# Altium schematic sheet Carrier.SchDoc
size A1; SheetNumber: 1; SheetTotal: 3
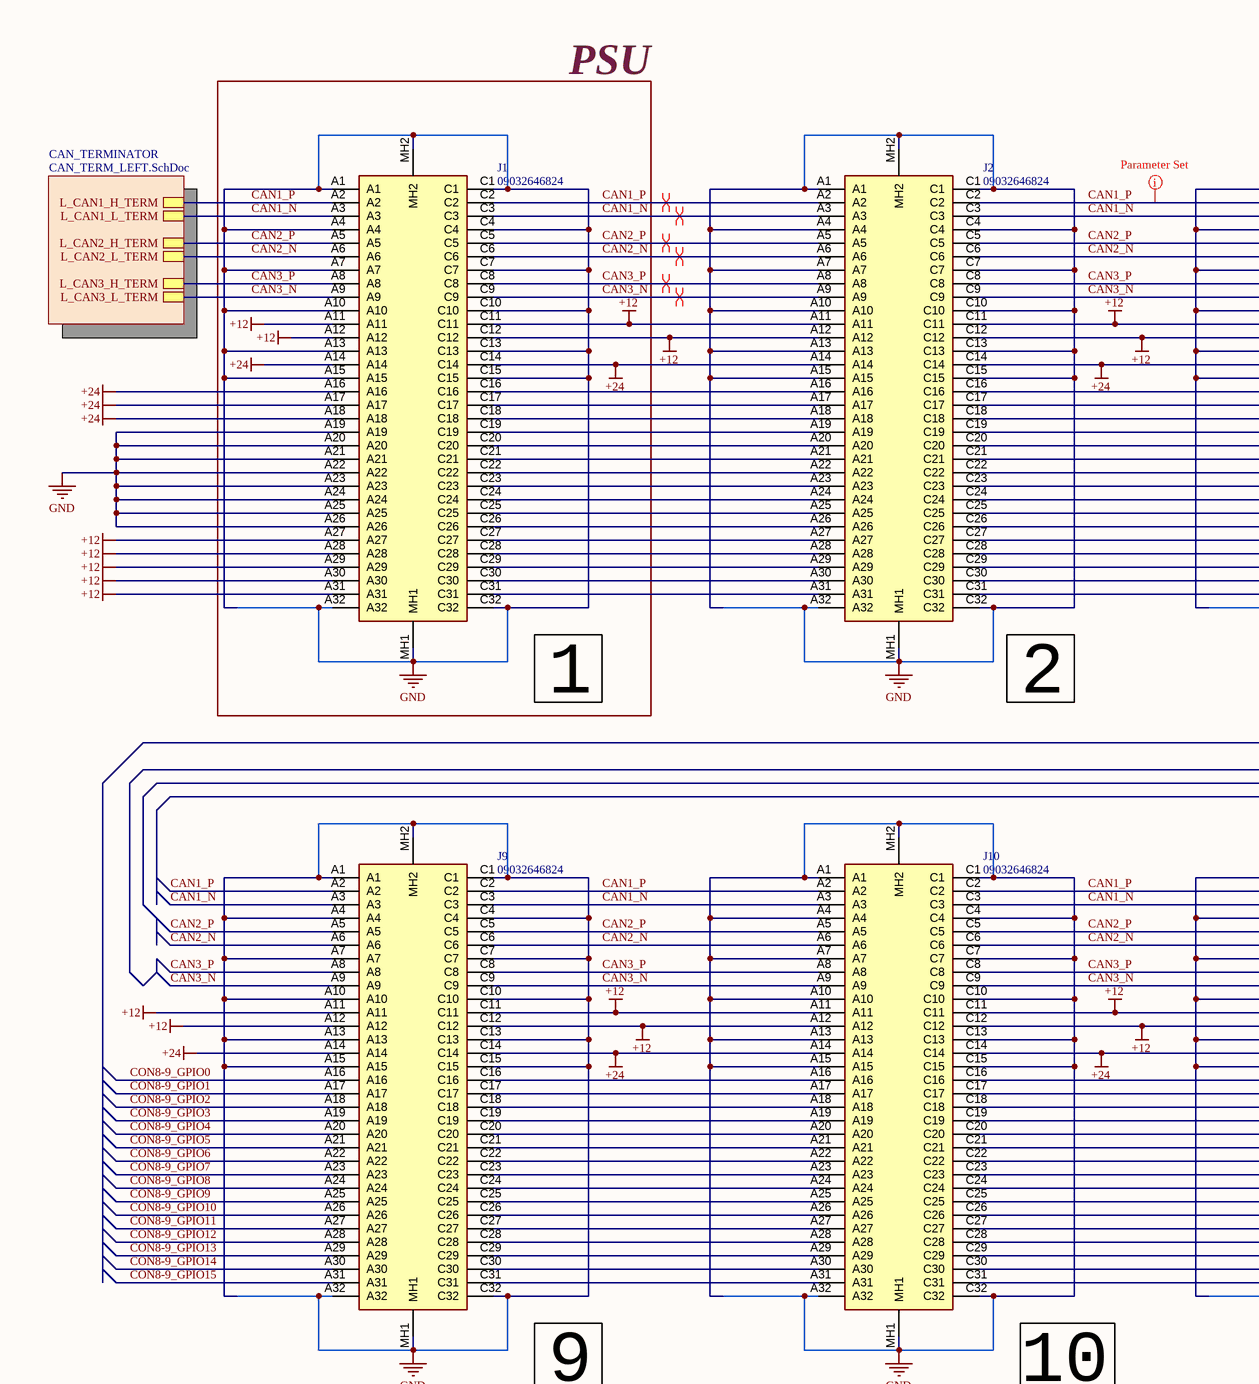
[diagram p0: Carrier.SchDoc, top left]
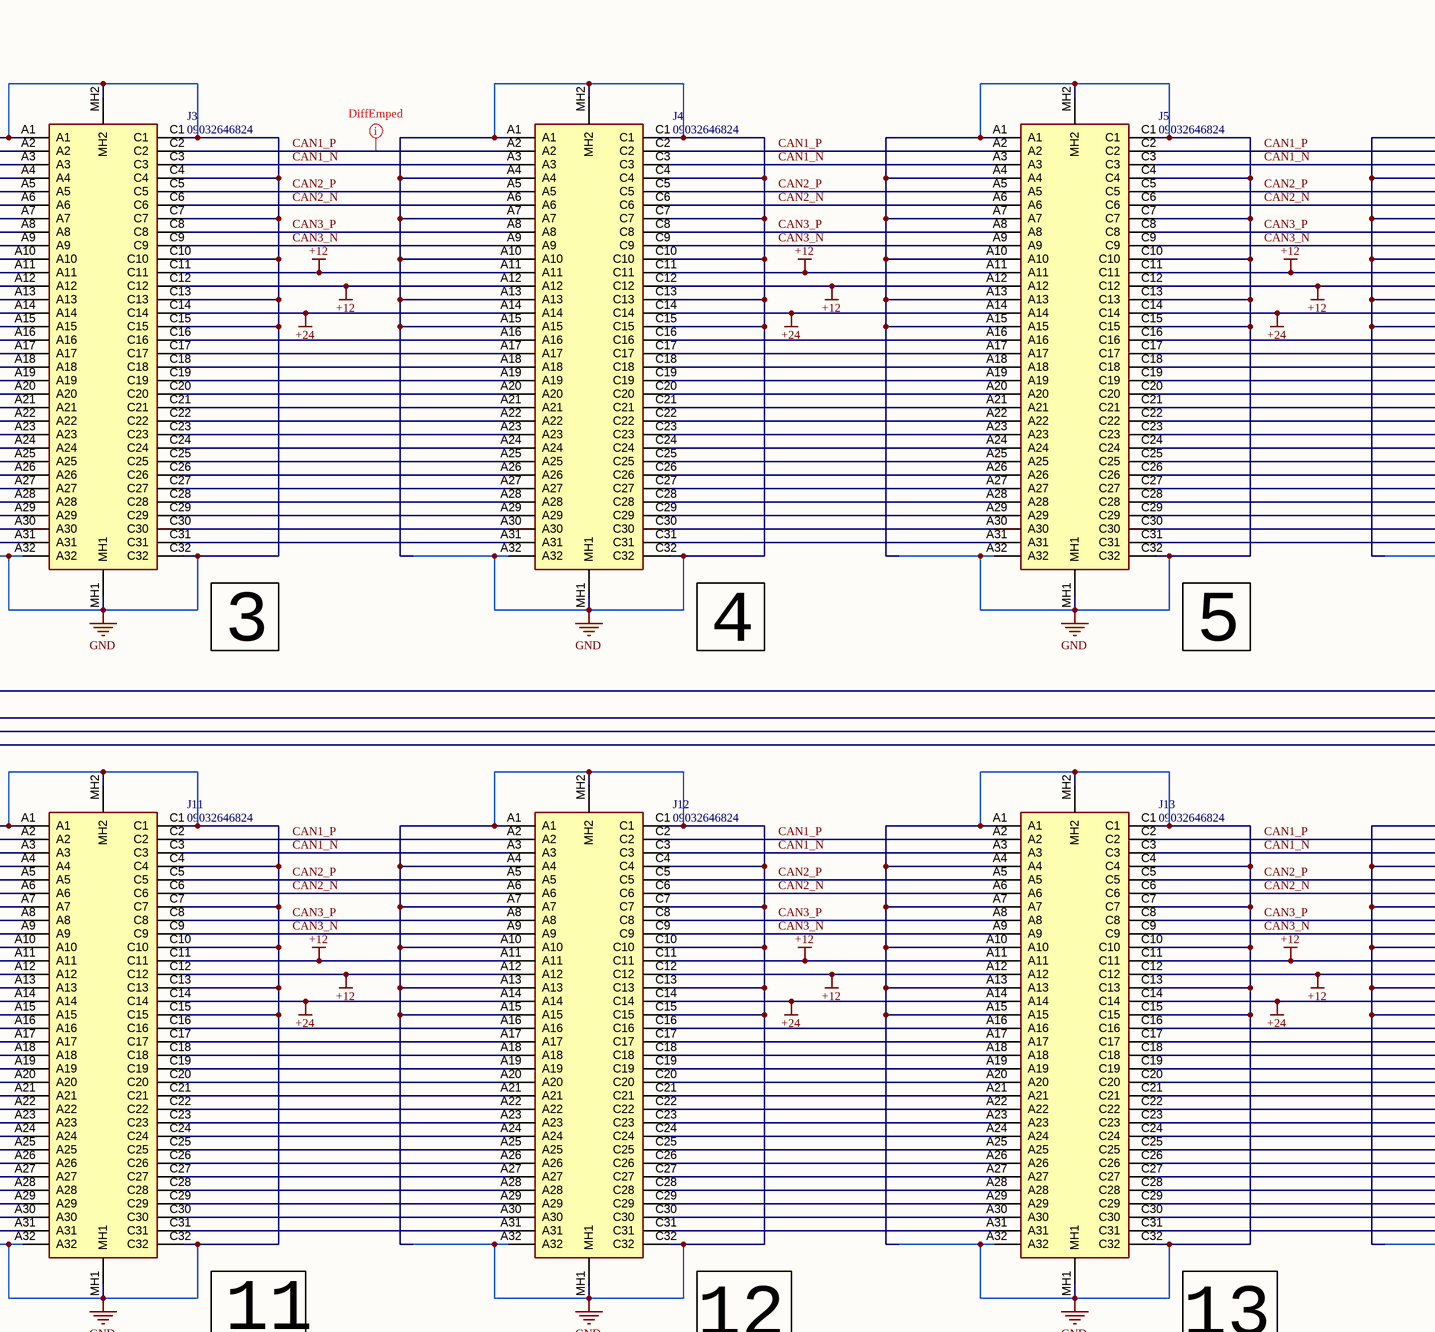
[diagram p1: Carrier.SchDoc, top middle]
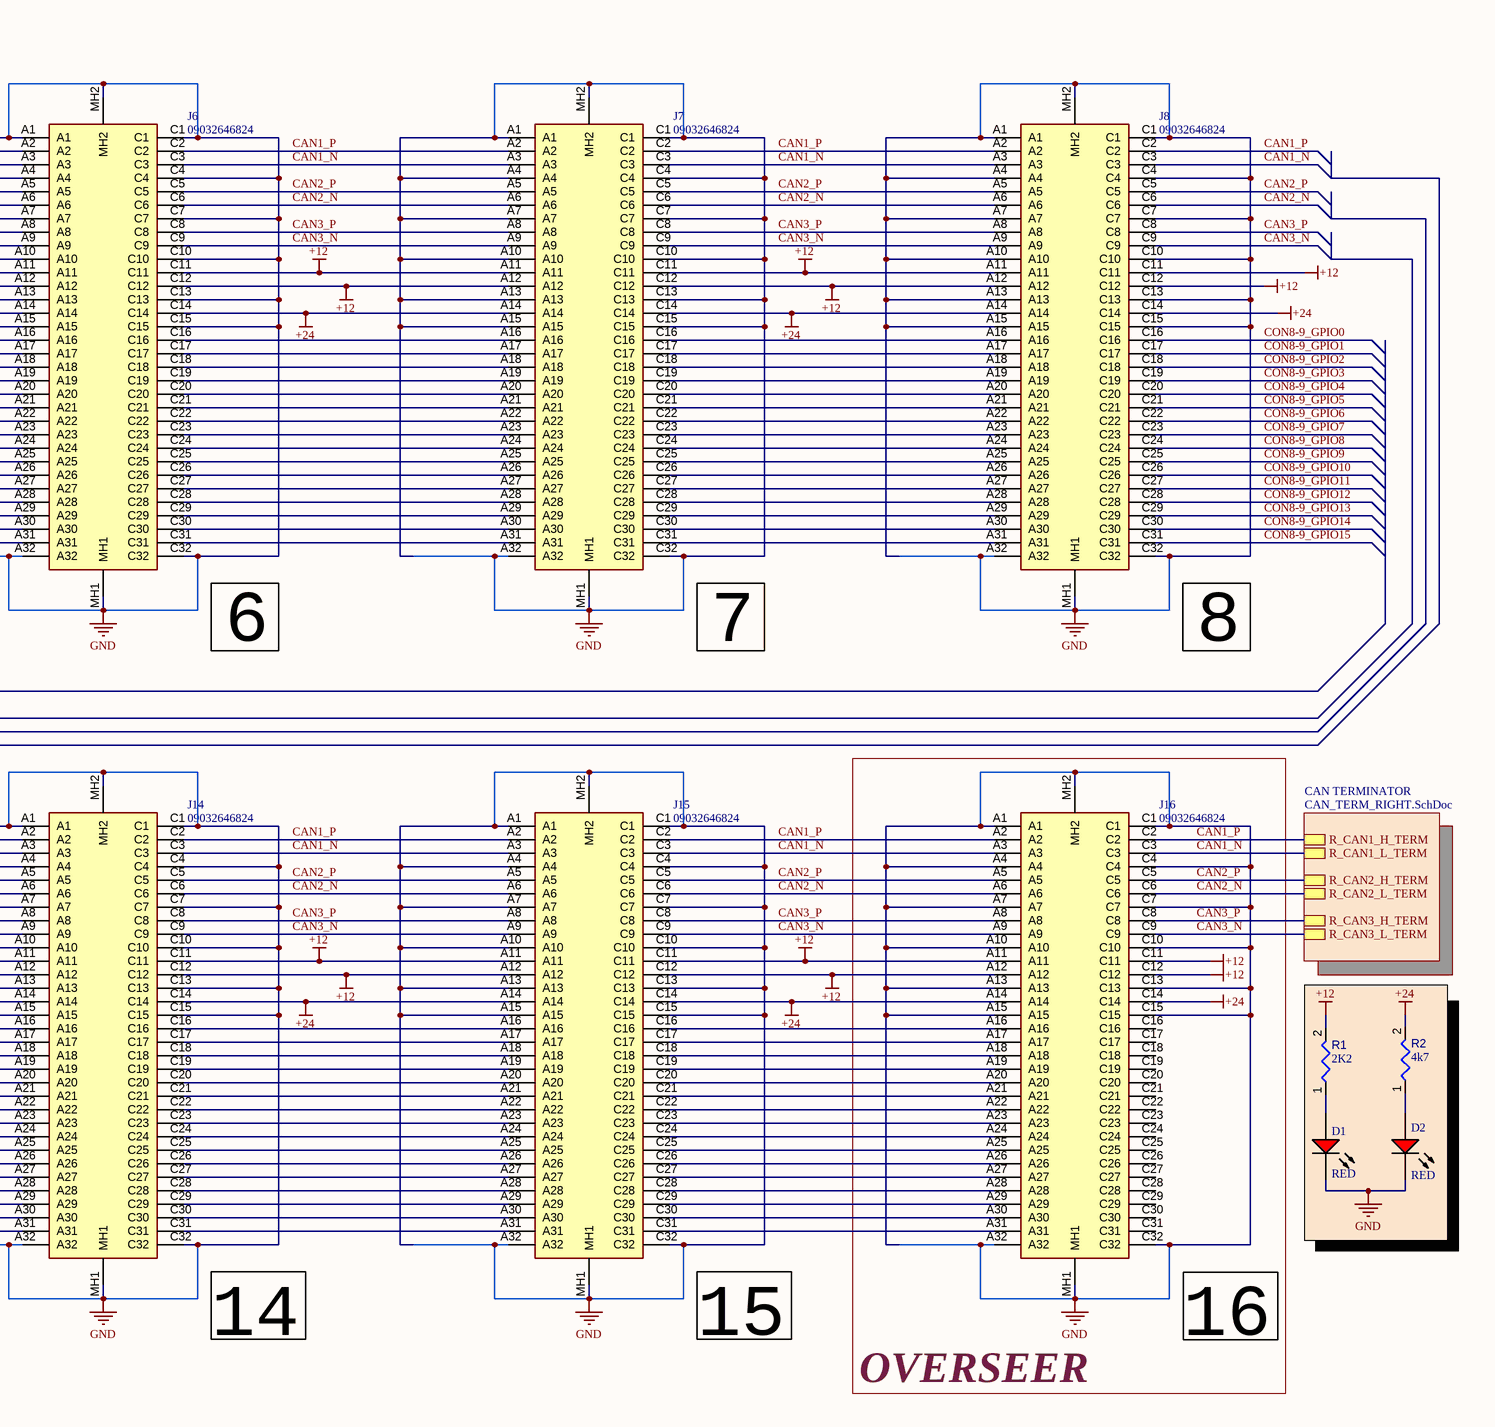
[diagram p2: Carrier.SchDoc, top right]
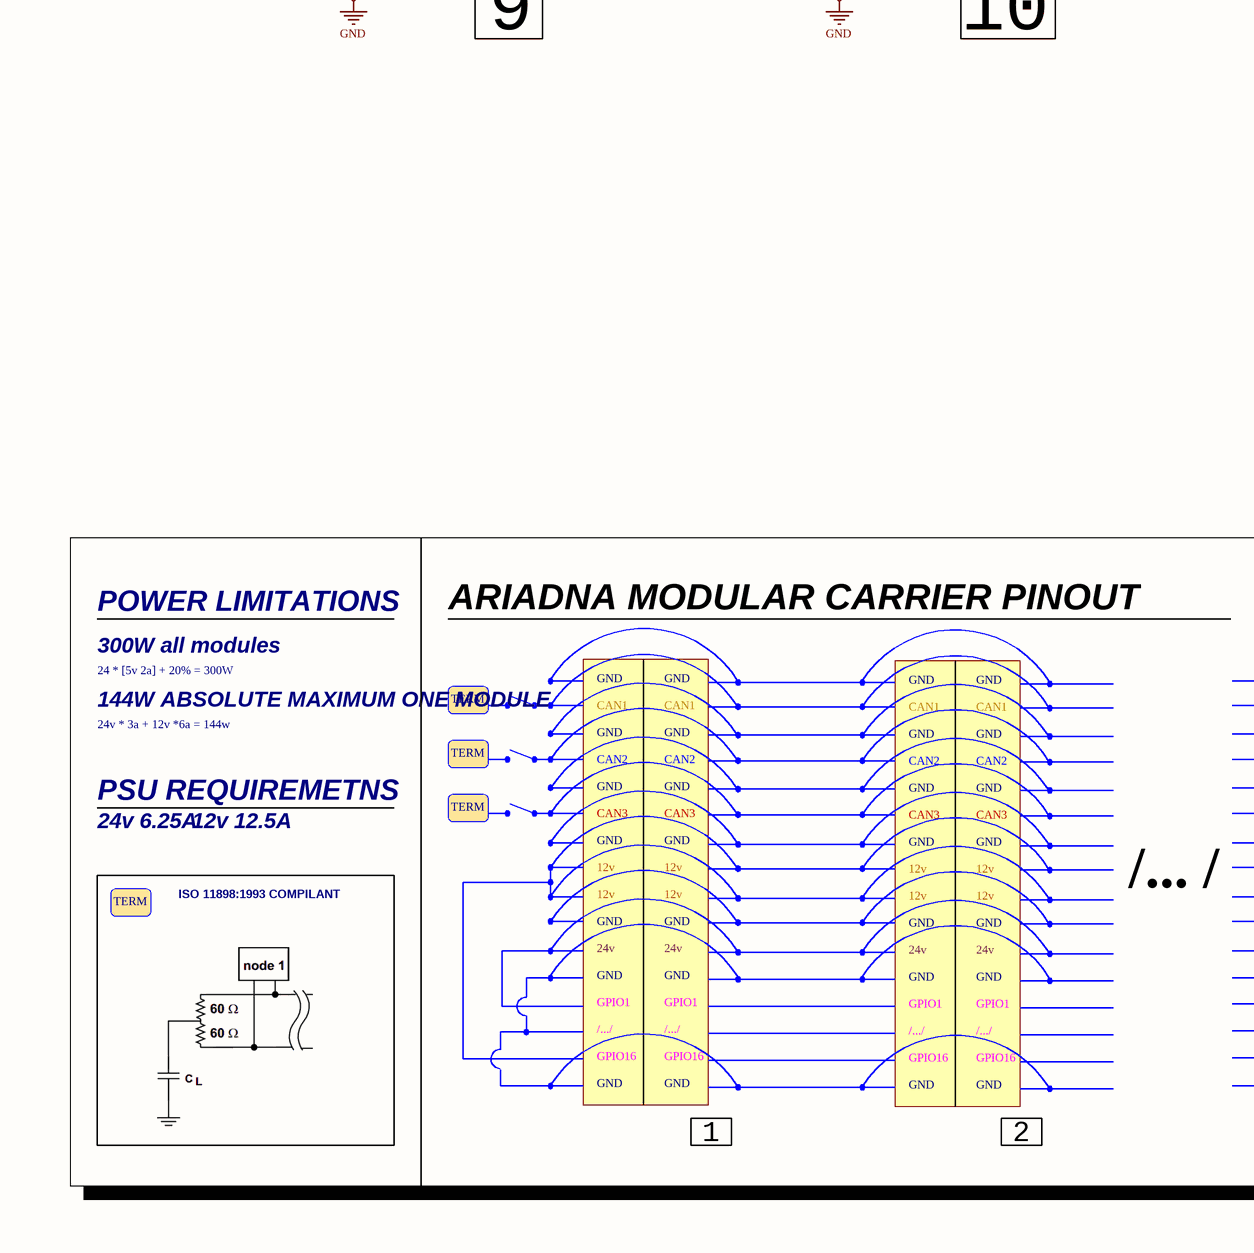
[diagram p3: Carrier.SchDoc, bottom left]
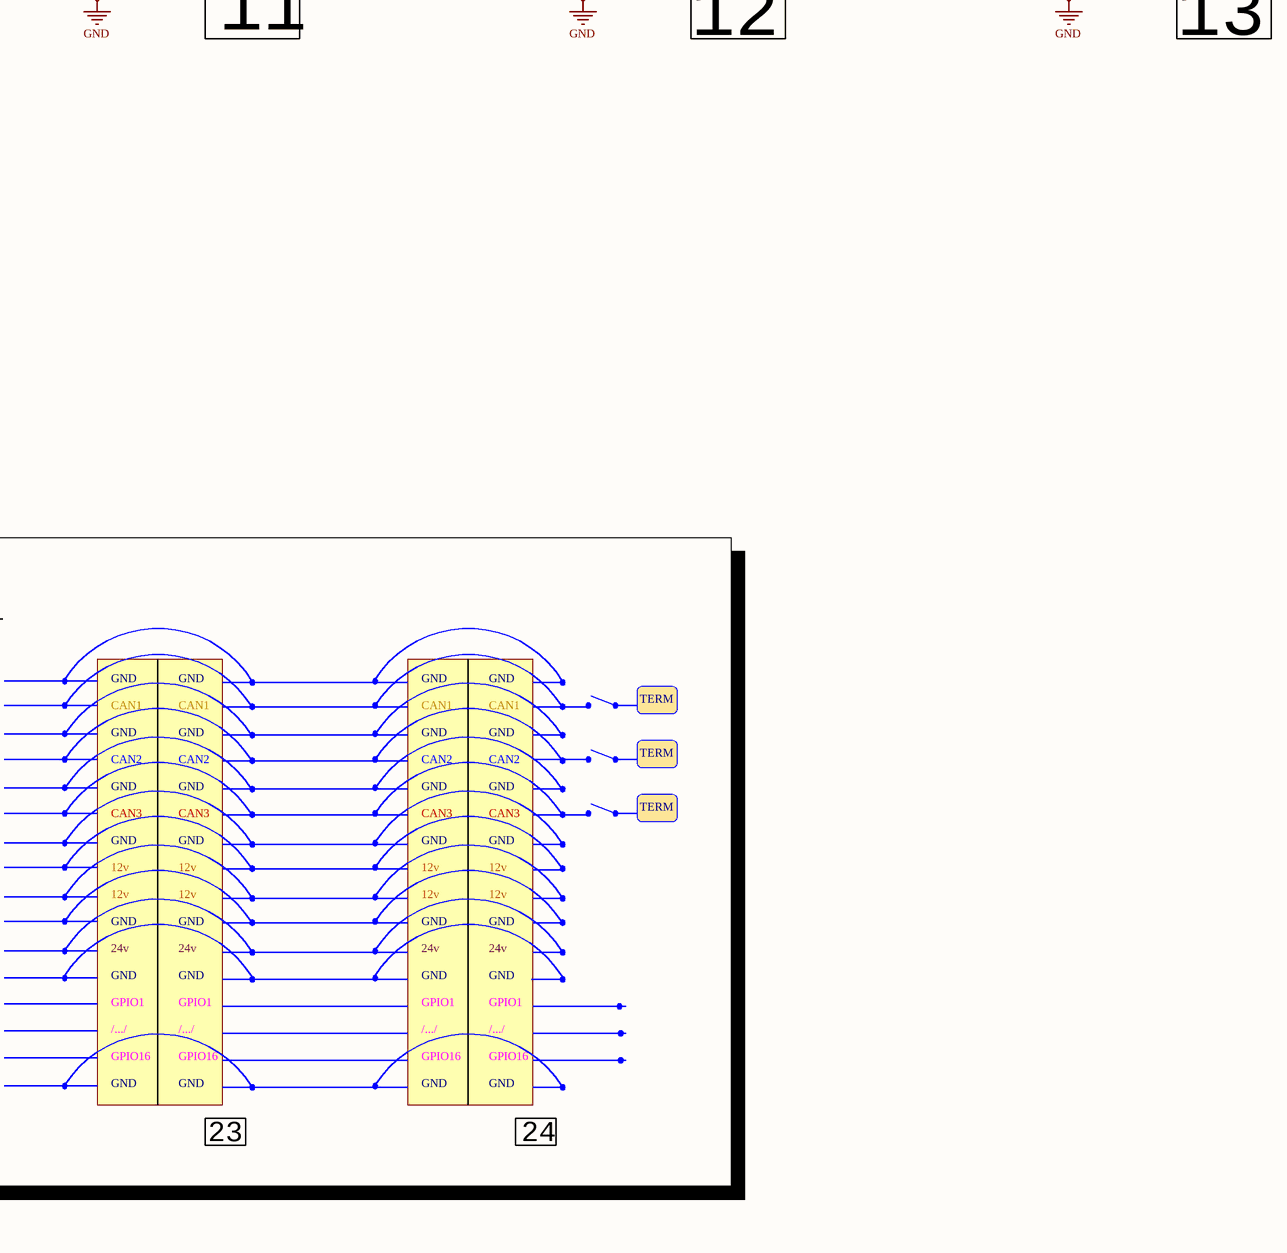
[diagram p4: Carrier.SchDoc, bottom middle]
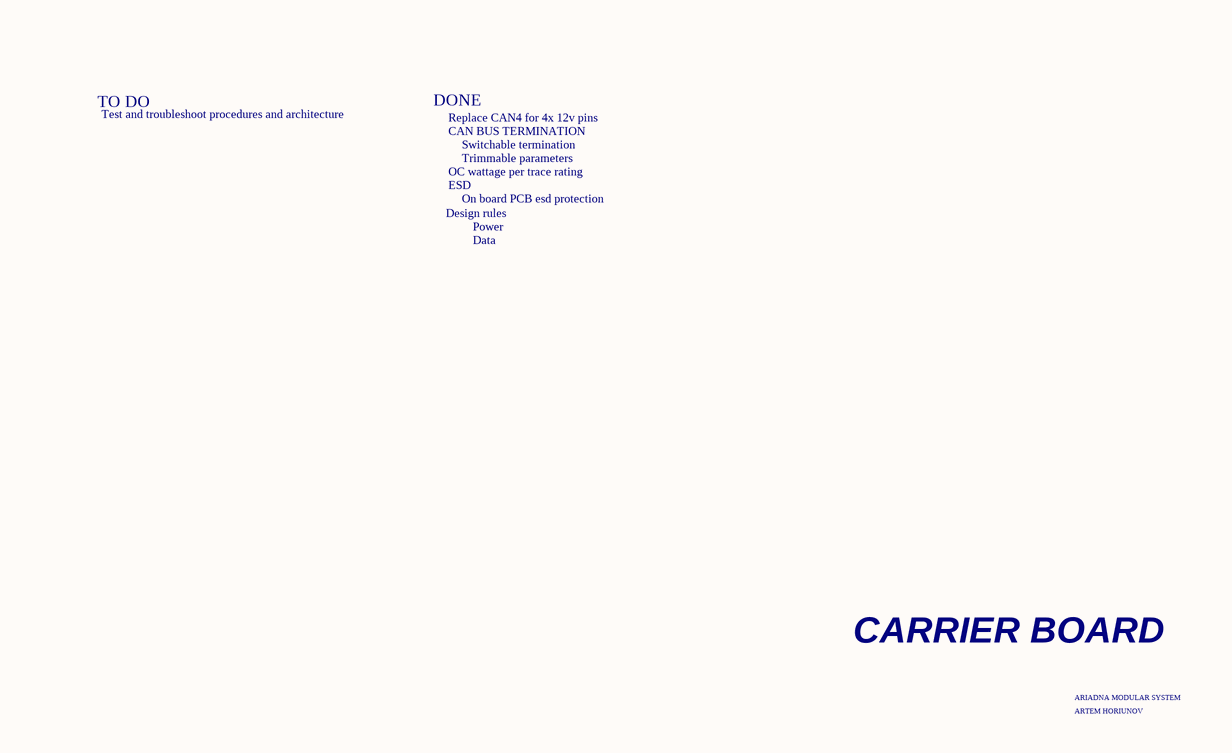
[diagram p5: Carrier.SchDoc, bottom right]

## Parts
D1  RED  [AVAG-HSMX-C190_V]
D2  RED  [AVAG-HSMX-C190_V]
J1  09032646824  [09032646824]
J2  09032646824  [09032646824]
J3  09032646824  [09032646824]
J4  09032646824  [09032646824]
J5  09032646824  [09032646824]
J6  09032646824  [09032646824]
J7  09032646824  [09032646824]
J8  09032646824  [09032646824]
J9  09032646824  [09032646824]
J10  09032646824  [09032646824]
J11  09032646824  [09032646824]
J12  09032646824  [09032646824]
J13  09032646824  [09032646824]
J14  09032646824  [09032646824]
J15  09032646824  [09032646824]
J16  09032646824  [09032646824]
R1  value 2K2  [RESC0805(2012)_L]  (hidden comment: 4D7R5J)
R2  value 4k7  [RESC0805(2012)_L]  (hidden comment: 4D7R5J)

## Blocks framed on the sheet
1: J1
16: J16

## Sub-sheets
CAN TERMINATOR = CAN_TERM_RIGHT.SchDoc: R_CAN1_H_TERM, R_CAN1_L_TERM, R_CAN2_H_TERM, R_CAN2_L_TERM, R_CAN3_H_TERM, R_CAN3_L_TERM
CAN_TERMINATOR = CAN_TERM_LEFT.SchDoc: L_CAN1_H_TERM, L_CAN1_L_TERM, L_CAN2_H_TERM, L_CAN2_L_TERM, L_CAN3_H_TERM, L_CAN3_L_TERM

## Nets
+12: J1.A11 J1.A12 J1.A27 J1.A28 J1.A29 J1.A30 J1.A31 J1.C11 J1.C12 J2.A11 J2.A12 J2.C11 J2.C12 J3.A11 J3.A12 J3.C11 J3.C12 J4.A11 J4.A12 J4.C11 J4.C12 J5.A11 J5.A12 J5.C11 J5.C12 J6.A11 J6.A12 J6.C11 J6.C12 J7.A11 J7.A12 J7.C11 J7.C12 J8.A11 J8.A12 J8.C11 J8.C12 J9.A11 J9.A12 J9.C11 J9.C12 J10.A11 J10.A12 J10.C11 J10.C12 J11.A11 J11.A12 J11.C11 J11.C12 J12.A11 J12.A12 J12.C11 J12.C12 J13.A11 J13.A12 J13.C11 J13.C12 J14.A11 J14.A12 J14.C11 J14.C12 J15.A11 J15.A12 J15.C11 J15.C12 J16.A11 J16.A12 J16.C11 J16.C12 R1.2
+24: J1.A14 J1.A16 J1.A17 J1.A18 J1.C14 J2.A14 J2.C14 J3.A14 J3.C14 J4.A14 J4.C14 J5.A14 J5.C14 J6.A14 J6.C14 J7.A14 J7.C14 J8.A14 J8.C14 J9.A14 J9.C14 J10.A14 J10.C14 J11.A14 J11.C14 J12.A14 J12.C14 J13.A14 J13.C14 J14.A14 J14.C14 J15.A14 J15.C14 J16.A14 J16.C14 R2.2
GND: D1.2(K) D2.2(K) J1.A1 J1.A4 J1.A7 J1.A10 J1.A13 J1.A15 J1.A19 J1.A20 J1.A21 J1.A22 J1.A23 J1.A24 J1.A25 J1.A26 J1.A32 J1.C1 J1.C4 J1.C7 J1.C10 J1.C13 J1.C15 J1.C32 J1.MH1 J1.MH2 J2.A1 J2.A4 J2.A7 J2.A10 J2.A13 J2.A15 J2.A32 J2.C1 J2.C4 J2.C7 J2.C10 J2.C13 J2.C15 J2.C32 J2.MH1 J2.MH2 J3.A1 J3.A4 J3.A7 J3.A10 J3.A13 J3.A15 J3.A32 J3.C1 J3.C4 J3.C7 J3.C10 J3.C13 J3.C15 J3.C32 J3.MH1 J3.MH2 J4.A1 J4.A4 J4.A7 J4.A10 J4.A13 J4.A15 J4.A32 J4.C1 J4.C4 J4.C7 J4.C10 J4.C13 J4.C15 J4.C32 J4.MH1 J4.MH2 J5.A1 J5.A4 J5.A7 J5.A10 J5.A13 J5.A15 J5.A32 J5.C1 J5.C4 J5.C7 J5.C10 J5.C13 J5.C15 J5.C32 J5.MH1 J5.MH2 J6.A1 J6.A4 J6.A7 J6.A10 J6.A13 J6.A15 J6.A32 J6.C1 J6.C4 J6.C7 J6.C10 J6.C13 J6.C15 J6.C32 J6.MH1 J6.MH2 J7.A1 J7.A4 J7.A7 J7.A10 J7.A13 J7.A15 J7.A32 J7.C1 J7.C4 J7.C7 J7.C10 J7.C13 J7.C15 J7.C32 J7.MH1 J7.MH2 J8.A1 J8.A4 J8.A7 J8.A10 J8.A13 J8.A15 J8.A32 J8.C1 J8.C4 J8.C7 J8.C10 J8.C13 J8.C15 J8.C32 J8.MH1 J8.MH2 J9.A1 J9.A4 J9.A7 J9.A10 J9.A13 J9.A15 J9.A32 J9.C1 J9.C4 J9.C7 J9.C10 J9.C13 J9.C15 J9.C32 J9.MH1 J9.MH2 J10.A1 J10.A4 J10.A7 J10.A10 J10.A13 J10.A15 J10.A32 J10.C1 J10.C4 J10.C7 J10.C10 J10.C13 J10.C15 J10.C32 J10.MH1 J10.MH2 J11.A1 J11.A4 J11.A7 J11.A10 J11.A13 J11.A15 J11.A32 J11.C1 J11.C4 J11.C7 J11.C10 J11.C13 J11.C15 J11.C32 J11.MH1 J11.MH2 J12.A1 J12.A4 J12.A7 J12.A10 J12.A13 J12.A15 J12.A32 J12.C1 J12.C4 J12.C7 J12.C10 J12.C13 J12.C15 J12.C32 J12.MH1 J12.MH2 J13.A1 J13.A4 J13.A7 J13.A10 J13.A13 J13.A15 J13.A32 J13.C1 J13.C4 J13.C7 J13.C10 J13.C13 J13.C15 J13.C32 J13.MH1 J13.MH2 J14.A1 J14.A4 J14.A7 J14.A10 J14.A13 J14.A15 J14.A32 J14.C1 J14.C4 J14.C7 J14.C10 J14.C13 J14.C15 J14.C32 J14.MH1 J14.MH2 J15.A1 J15.A4 J15.A7 J15.A10 J15.A13 J15.A15 J15.A32 J15.C1 J15.C4 J15.C7 J15.C10 J15.C13 J15.C15 J15.C32 J15.MH1 J15.MH2 J16.A1 J16.A4 J16.A7 J16.A10 J16.A13 J16.A15 J16.A32 J16.C1 J16.C4 J16.C7 J16.C10 J16.C13 J16.C15 J16.C32 J16.MH1 J16.MH2
CAN1_N: J1.A3 J1.C3 J2.A3 J2.C3 J3.A3 J3.C3 J4.A3 J4.C3 J5.A3 J5.C3 J6.A3 J6.C3 J7.A3 J7.C3 J8.A3 J8.C3 J9.A3 J9.C3 J10.A3 J10.C3 J11.A3 J11.C3 J12.A3 J12.C3 J13.A3 J13.C3 J14.A3 J14.C3 J15.A3 J15.C3 J16.A3 J16.C3 ; sheet CAN_TERMINATOR/L_CAN1_L_TERM, sheet CAN TERMINATOR/R_CAN1_L_TERM
CAN1_P: J1.A2 J1.C2 J2.A2 J2.C2 J3.A2 J3.C2 J4.A2 J4.C2 J5.A2 J5.C2 J6.A2 J6.C2 J7.A2 J7.C2 J8.A2 J8.C2 J9.A2 J9.C2 J10.A2 J10.C2 J11.A2 J11.C2 J12.A2 J12.C2 J13.A2 J13.C2 J14.A2 J14.C2 J15.A2 J15.C2 J16.A2 J16.C2 ; sheet CAN_TERMINATOR/L_CAN1_H_TERM, sheet CAN TERMINATOR/R_CAN1_H_TERM
CAN2_N: J1.A6 J1.C6 J2.A6 J2.C6 J3.A6 J3.C6 J4.A6 J4.C6 J5.A6 J5.C6 J6.A6 J6.C6 J7.A6 J7.C6 J8.A6 J8.C6 J9.A6 J9.C6 J10.A6 J10.C6 J11.A6 J11.C6 J12.A6 J12.C6 J13.A6 J13.C6 J14.A6 J14.C6 J15.A6 J15.C6 J16.A6 J16.C6 ; sheet CAN_TERMINATOR/L_CAN2_L_TERM, sheet CAN TERMINATOR/R_CAN2_L_TERM
CAN2_P: J1.A5 J1.C5 J2.A5 J2.C5 J3.A5 J3.C5 J4.A5 J4.C5 J5.A5 J5.C5 J6.A5 J6.C5 J7.A5 J7.C5 J8.A5 J8.C5 J9.A5 J9.C5 J10.A5 J10.C5 J11.A5 J11.C5 J12.A5 J12.C5 J13.A5 J13.C5 J14.A5 J14.C5 J15.A5 J15.C5 J16.A5 J16.C5 ; sheet CAN_TERMINATOR/L_CAN2_H_TERM, sheet CAN TERMINATOR/R_CAN2_H_TERM
CAN3_N: J1.A9 J1.C9 J2.A9 J2.C9 J3.A9 J3.C9 J4.A9 J4.C9 J5.A9 J5.C9 J6.A9 J6.C9 J7.A9 J7.C9 J8.A9 J8.C9 J9.A9 J9.C9 J10.A9 J10.C9 J11.A9 J11.C9 J12.A9 J12.C9 J13.A9 J13.C9 J14.A9 J14.C9 J15.A9 J15.C9 J16.A9 J16.C9 ; sheet CAN_TERMINATOR/L_CAN3_L_TERM, sheet CAN TERMINATOR/R_CAN3_L_TERM
CAN3_P: J1.A8 J1.C8 J2.A8 J2.C8 J3.A8 J3.C8 J4.A8 J4.C8 J5.A8 J5.C8 J6.A8 J6.C8 J7.A8 J7.C8 J8.A8 J8.C8 J9.A8 J9.C8 J10.A8 J10.C8 J11.A8 J11.C8 J12.A8 J12.C8 J13.A8 J13.C8 J14.A8 J14.C8 J15.A8 J15.C8 J16.A8 J16.C8 ; sheet CAN_TERMINATOR/L_CAN3_H_TERM, sheet CAN TERMINATOR/R_CAN3_H_TERM
CON8-9_GPIO0: J8.C16 J9.A16
CON8-9_GPIO1: J8.C17 J9.A17
CON8-9_GPIO2: J8.C18 J9.A18
CON8-9_GPIO3: J8.C19 J9.A19
CON8-9_GPIO4: J8.C20 J9.A20
CON8-9_GPIO5: J8.C21 J9.A21
CON8-9_GPIO6: J8.C22 J9.A22
CON8-9_GPIO7: J8.C23 J9.A23
CON8-9_GPIO8: J8.C24 J9.A24
CON8-9_GPIO9: J8.C25 J9.A25
CON8-9_GPIO10: J8.C26 J9.A26
CON8-9_GPIO11: J8.C27 J9.A27
CON8-9_GPIO12: J8.C28 J9.A28
CON8-9_GPIO13: J8.C29 J9.A29
CON8-9_GPIO14: J8.C30 J9.A30
CON8-9_GPIO15: J8.C31 J9.A31
NetD1_1: D1.1(A) R1.1
NetD2_1: D2.1(A) R2.1
NetJ1_C16: J1.C16 J2.A16
NetJ1_C17: J1.C17 J2.A17
NetJ1_C18: J1.C18 J2.A18
NetJ1_C19: J1.C19 J2.A19
NetJ1_C20: J1.C20 J2.A20
NetJ1_C21: J1.C21 J2.A21
NetJ1_C22: J1.C22 J2.A22
NetJ1_C23: J1.C23 J2.A23
NetJ1_C24: J1.C24 J2.A24
NetJ1_C25: J1.C25 J2.A25
NetJ1_C26: J1.C26 J2.A26
NetJ1_C27: J1.C27 J2.A27
NetJ1_C28: J1.C28 J2.A28
NetJ1_C29: J1.C29 J2.A29
NetJ1_C30: J1.C30 J2.A30
NetJ1_C31: J1.C31 J2.A31
NetJ2_C16: J2.C16 J3.A16
NetJ2_C17: J2.C17 J3.A17
NetJ2_C18: J2.C18 J3.A18
NetJ2_C19: J2.C19 J3.A19
NetJ2_C20: J2.C20 J3.A20
NetJ2_C21: J2.C21 J3.A21
NetJ2_C22: J2.C22 J3.A22
NetJ2_C23: J2.C23 J3.A23
NetJ2_C24: J2.C24 J3.A24
NetJ2_C25: J2.C25 J3.A25
NetJ2_C26: J2.C26 J3.A26
NetJ2_C27: J2.C27 J3.A27
NetJ2_C28: J2.C28 J3.A28
NetJ2_C29: J2.C29 J3.A29
NetJ2_C30: J2.C30 J3.A30
NetJ2_C31: J2.C31 J3.A31
NetJ3_C16: J3.C16 J4.A16
NetJ3_C17: J3.C17 J4.A17
NetJ3_C18: J3.C18 J4.A18
NetJ3_C19: J3.C19 J4.A19
NetJ3_C20: J3.C20 J4.A20
NetJ3_C21: J3.C21 J4.A21
NetJ3_C22: J3.C22 J4.A22
NetJ3_C23: J3.C23 J4.A23
NetJ3_C24: J3.C24 J4.A24
NetJ3_C25: J3.C25 J4.A25
NetJ3_C26: J3.C26 J4.A26
NetJ3_C27: J3.C27 J4.A27
NetJ3_C28: J3.C28 J4.A28
NetJ3_C29: J3.C29 J4.A29
NetJ3_C30: J3.C30 J4.A30
NetJ3_C31: J3.C31 J4.A31
NetJ4_C16: J4.C16 J5.A16
NetJ4_C17: J4.C17 J5.A17
NetJ4_C18: J4.C18 J5.A18
NetJ4_C19: J4.C19 J5.A19
NetJ4_C20: J4.C20 J5.A20
NetJ4_C21: J4.C21 J5.A21
NetJ4_C22: J4.C22 J5.A22
NetJ4_C23: J4.C23 J5.A23
NetJ4_C24: J4.C24 J5.A24
NetJ4_C25: J4.C25 J5.A25
NetJ4_C26: J4.C26 J5.A26
NetJ4_C27: J4.C27 J5.A27
NetJ4_C28: J4.C28 J5.A28
NetJ4_C29: J4.C29 J5.A29
NetJ4_C30: J4.C30 J5.A30
NetJ4_C31: J4.C31 J5.A31
NetJ5_C16: J5.C16 J6.A16
NetJ5_C17: J5.C17 J6.A17
NetJ5_C18: J5.C18 J6.A18
NetJ5_C19: J5.C19 J6.A19
NetJ5_C20: J5.C20 J6.A20
NetJ5_C21: J5.C21 J6.A21
NetJ5_C22: J5.C22 J6.A22
NetJ5_C23: J5.C23 J6.A23
NetJ5_C24: J5.C24 J6.A24
NetJ5_C25: J5.C25 J6.A25
NetJ5_C26: J5.C26 J6.A26
NetJ5_C27: J5.C27 J6.A27
NetJ5_C28: J5.C28 J6.A28
NetJ5_C29: J5.C29 J6.A29
NetJ5_C30: J5.C30 J6.A30
NetJ5_C31: J5.C31 J6.A31
NetJ6_C16: J6.C16 J7.A16
NetJ6_C17: J6.C17 J7.A17
NetJ6_C18: J6.C18 J7.A18
NetJ6_C19: J6.C19 J7.A19
NetJ6_C20: J6.C20 J7.A20
NetJ6_C21: J6.C21 J7.A21
NetJ6_C22: J6.C22 J7.A22
NetJ6_C23: J6.C23 J7.A23
NetJ6_C24: J6.C24 J7.A24
NetJ6_C25: J6.C25 J7.A25
NetJ6_C26: J6.C26 J7.A26
NetJ6_C27: J6.C27 J7.A27
NetJ6_C28: J6.C28 J7.A28
NetJ6_C29: J6.C29 J7.A29
NetJ6_C30: J6.C30 J7.A30
NetJ6_C31: J6.C31 J7.A31
NetJ7_C16: J7.C16 J8.A16
NetJ7_C17: J7.C17 J8.A17
NetJ7_C18: J7.C18 J8.A18
NetJ7_C19: J7.C19 J8.A19
NetJ7_C20: J7.C20 J8.A20
NetJ7_C21: J7.C21 J8.A21
NetJ7_C22: J7.C22 J8.A22
NetJ7_C23: J7.C23 J8.A23
NetJ7_C24: J7.C24 J8.A24
NetJ7_C25: J7.C25 J8.A25
NetJ7_C26: J7.C26 J8.A26
NetJ7_C27: J7.C27 J8.A27
NetJ7_C28: J7.C28 J8.A28
NetJ7_C29: J7.C29 J8.A29
NetJ7_C30: J7.C30 J8.A30
NetJ7_C31: J7.C31 J8.A31
NetJ9_C16: J9.C16 J10.A16
NetJ9_C17: J9.C17 J10.A17
NetJ9_C18: J9.C18 J10.A18
NetJ9_C19: J9.C19 J10.A19
NetJ9_C20: J9.C20 J10.A20
NetJ9_C21: J9.C21 J10.A21
NetJ9_C22: J9.C22 J10.A22
NetJ9_C23: J9.C23 J10.A23
NetJ9_C24: J9.C24 J10.A24
NetJ9_C25: J9.C25 J10.A25
NetJ9_C26: J9.C26 J10.A26
NetJ9_C27: J9.C27 J10.A27
NetJ9_C28: J9.C28 J10.A28
NetJ9_C29: J9.C29 J10.A29
NetJ9_C30: J9.C30 J10.A30
NetJ9_C31: J9.C31 J10.A31
NetJ10_C16: J10.C16 J11.A16
NetJ10_C17: J10.C17 J11.A17
NetJ10_C18: J10.C18 J11.A18
NetJ10_C19: J10.C19 J11.A19
NetJ10_C20: J10.C20 J11.A20
NetJ10_C21: J10.C21 J11.A21
NetJ10_C22: J10.C22 J11.A22
NetJ10_C23: J10.C23 J11.A23
NetJ10_C24: J10.C24 J11.A24
NetJ10_C25: J10.C25 J11.A25
NetJ10_C26: J10.C26 J11.A26
NetJ10_C27: J10.C27 J11.A27
NetJ10_C28: J10.C28 J11.A28
NetJ10_C29: J10.C29 J11.A29
NetJ10_C30: J10.C30 J11.A30
NetJ10_C31: J10.C31 J11.A31
NetJ11_C16: J11.C16 J12.A16
NetJ11_C17: J11.C17 J12.A17
NetJ11_C18: J11.C18 J12.A18
NetJ11_C19: J11.C19 J12.A19
NetJ11_C20: J11.C20 J12.A20
NetJ11_C21: J11.C21 J12.A21
NetJ11_C22: J11.C22 J12.A22
NetJ11_C23: J11.C23 J12.A23
NetJ11_C24: J11.C24 J12.A24
NetJ11_C25: J11.C25 J12.A25
NetJ11_C26: J11.C26 J12.A26
NetJ11_C27: J11.C27 J12.A27
NetJ11_C28: J11.C28 J12.A28
NetJ11_C29: J11.C29 J12.A29
NetJ11_C30: J11.C30 J12.A30
NetJ11_C31: J11.C31 J12.A31
NetJ12_C16: J12.C16 J13.A16
NetJ12_C17: J12.C17 J13.A17
NetJ12_C18: J12.C18 J13.A18
NetJ12_C19: J12.C19 J13.A19
NetJ12_C20: J12.C20 J13.A20
NetJ12_C21: J12.C21 J13.A21
NetJ12_C22: J12.C22 J13.A22
NetJ12_C23: J12.C23 J13.A23
NetJ12_C24: J12.C24 J13.A24
NetJ12_C25: J12.C25 J13.A25
NetJ12_C26: J12.C26 J13.A26
NetJ12_C27: J12.C27 J13.A27
NetJ12_C28: J12.C28 J13.A28
NetJ12_C29: J12.C29 J13.A29
NetJ12_C30: J12.C30 J13.A30
NetJ12_C31: J12.C31 J13.A31
NetJ13_C16: J13.C16 J14.A16
NetJ13_C17: J13.C17 J14.A17
NetJ13_C18: J13.C18 J14.A18
NetJ13_C19: J13.C19 J14.A19
NetJ13_C20: J13.C20 J14.A20
NetJ13_C21: J13.C21 J14.A21
NetJ13_C22: J13.C22 J14.A22
NetJ13_C23: J13.C23 J14.A23
NetJ13_C24: J13.C24 J14.A24
NetJ13_C25: J13.C25 J14.A25
NetJ13_C26: J13.C26 J14.A26
NetJ13_C27: J13.C27 J14.A27
NetJ13_C28: J13.C28 J14.A28
NetJ13_C29: J13.C29 J14.A29
NetJ13_C30: J13.C30 J14.A30
NetJ13_C31: J13.C31 J14.A31
NetJ14_C16: J14.C16 J15.A16
NetJ14_C17: J14.C17 J15.A17
NetJ14_C18: J14.C18 J15.A18
NetJ14_C19: J14.C19 J15.A19
NetJ14_C20: J14.C20 J15.A20
NetJ14_C21: J14.C21 J15.A21
NetJ14_C22: J14.C22 J15.A22
NetJ14_C23: J14.C23 J15.A23
NetJ14_C24: J14.C24 J15.A24
NetJ14_C25: J14.C25 J15.A25
NetJ14_C26: J14.C26 J15.A26
NetJ14_C27: J14.C27 J15.A27
NetJ14_C28: J14.C28 J15.A28
NetJ14_C29: J14.C29 J15.A29
NetJ14_C30: J14.C30 J15.A30
NetJ14_C31: J14.C31 J15.A31
NetJ15_C16: J15.C16 J16.A16
NetJ15_C17: J15.C17 J16.A17
NetJ15_C18: J15.C18 J16.A18
NetJ15_C19: J15.C19 J16.A19
NetJ15_C20: J15.C20 J16.A20
NetJ15_C21: J15.C21 J16.A21
NetJ15_C22: J15.C22 J16.A22
NetJ15_C23: J15.C23 J16.A23
NetJ15_C24: J15.C24 J16.A24
NetJ15_C25: J15.C25 J16.A25
NetJ15_C26: J15.C26 J16.A26
NetJ15_C27: J15.C27 J16.A27
NetJ15_C28: J15.C28 J16.A28
NetJ15_C29: J15.C29 J16.A29
NetJ15_C30: J15.C30 J16.A30
NetJ15_C31: J15.C31 J16.A31

Not connected (* = marked no-connect by the designer): J16 C16 C17 C18 C19 C20 C21 C22 C23 C24 C25 C26 C27 C28 C29 C30 C31

## Layout directives
differential pair: CAN1_N, CAN1_P, CAN2_N, CAN2_P, CAN3_N, CAN3_P
rule Differential Pairs Routing [Pref Gap = 0.254mm    Min Gap  = 0.254mm    Max Gap  = 0.254mmPref Width = 0.381mm    Min Width  = 0.381mm    Max Width  = 0.381mm]: CAN1_P

## Notes on the sheet
- PSU
- 2
- 3
- 4
- 5
- 6
- 7
- 8
- 9
- 10
- 11
- 12
- 13
- 14
- 15
- OVERSEER
- POWER LIMITATIONS
- ARIADNA MODULAR CARRIER PINOUT
- 300W all modules
- 24 * [5v 2a] + 20% = 300W
- TERM
- GND
- TO DO
- DONE
- 144W ABSOLUTE MAXIMUM ONE MODULE
- 24v * 3a + 12v *6a = 144w
- CAN1
- CAN2
- Test and troubleshoot procedures and architecture
- CAN BUS TERMINATION
- OC wattage per trace rating
- Replace CAN4 for 4x 12v pins
- Switchable termination
- Trimmable parameters
- 24v 6.25A
- PSU REQUIREMETNS
- 12v 12.5A
- CAN3
- Design rules
- ESD
- On board PCB esd protection
- Power
- Data
- ISO 11898:1993 COMPILANT
- 12v
- /... /
- 24v
- GPIO1
- /.../
- GPIO16
- 1
- 23
- 24
- CARRIER BOARD
- ARIADNA MODULAR SYSTEM
- ARTEM HORIUNOV
- DWG. NO.
- REV.
- SHT.
- REVISION
- DESCRIPTION
- DATE
- APPROVED
- THIS DOCUMENT AND THE DATA DISCLOSED HEREIN OR HEREWITH IS THE PROPERTY OF ALTIUM LIMITED AND MAY BE FREELY DISTRIBUTED IN WHOLE. NO RIGHTS ARE RESERVED OR EXPRESS OR IMPLIED WARANTEE GIVEN.
- ENG:
- DSN:
- APPROVALS
- PROJECT
- DOCUMENT REVISION:
- DESIGN ITEM:
- CHK:
- BOM:
- REFERENCE DOCUMENTS
- PROJECT REVISION:
- TITLE
- FAB DWG:
- PCB DWG:
- ASSY DWG:
- SCALE:
- SIZE
- D
- CAGE CODE
- FILE NAME
- DWG NO.
- SHEET
- OF
- REV

## Library data of the parts
D1 D2 = CMP-1744-00004-1: LED Uni-Color Red, 65 mW, 20 mA, -40 to 85 degC, 2-Pin SMD, RoHS, Tape and Reel; Connector Type: USB; Gender: Male; Current Rating: 1 A; Length: 7.5 mm; Lead Pitch: 0.65 mm; PackageReference: HSMX-C190; Package Quantity: 2000; Max Operating Temperature: 85 degC; PackageDescription: 2-Pin Surface Mount Device, Body 1.6 x 0.8 mm, Height 0.9 mm; ComponentLink3Description: Package Specification; Mount: Surface Mount; Min Operating Temperature: -30 degC; ComponentLink3URL: http://www.fairchildsemi.com/dwg/MA/MA03D.pdf; ComponentLink1Description: Manufacturer URL; Contact Material: Copper; Pins: 5; Width: 5.6 mm; ComponentLink2Description: Datasheet; RoHSCompliant: true; DatasheetVersion: Mar-12; Height: 2.8 mm; Packaging: Tape and Reel; Contact Plating: Gold; ComponentLink1URL: http://www.avagotech.com/; REACH SVHC: No SVHC; ComponentLink2URL: http://docs.avagotech.com/docs/AV02-0551EN
J1-J16 = 09032646824: DIN C female straight 64pin, 2.9mm tails, PL2 (rows a,c loaded); Manufacturer_Name: HARTING; Geometry.Height: 11.6mm; Arrow Part Number: 09032646824; Arrow Price/Stock: https://www.arrow.com/en/products/09032646824/harting?region=europe; Manufacturer_Part_Number: 09032646824; Datasheet Link: https://www.arrow.com/en/products/09032646824/harting?region=europe
R1 R2 = CMP-009-00106-2: 4R7 0.125W 5% 0805 (2012 Metric)  SMD; Power: 125mW; Mounting Technology: SMT; Pins: 2; Case/Package: 0805; Tolerance: 5%